# EAGLE design SSROZ (EAGLE 5.07)
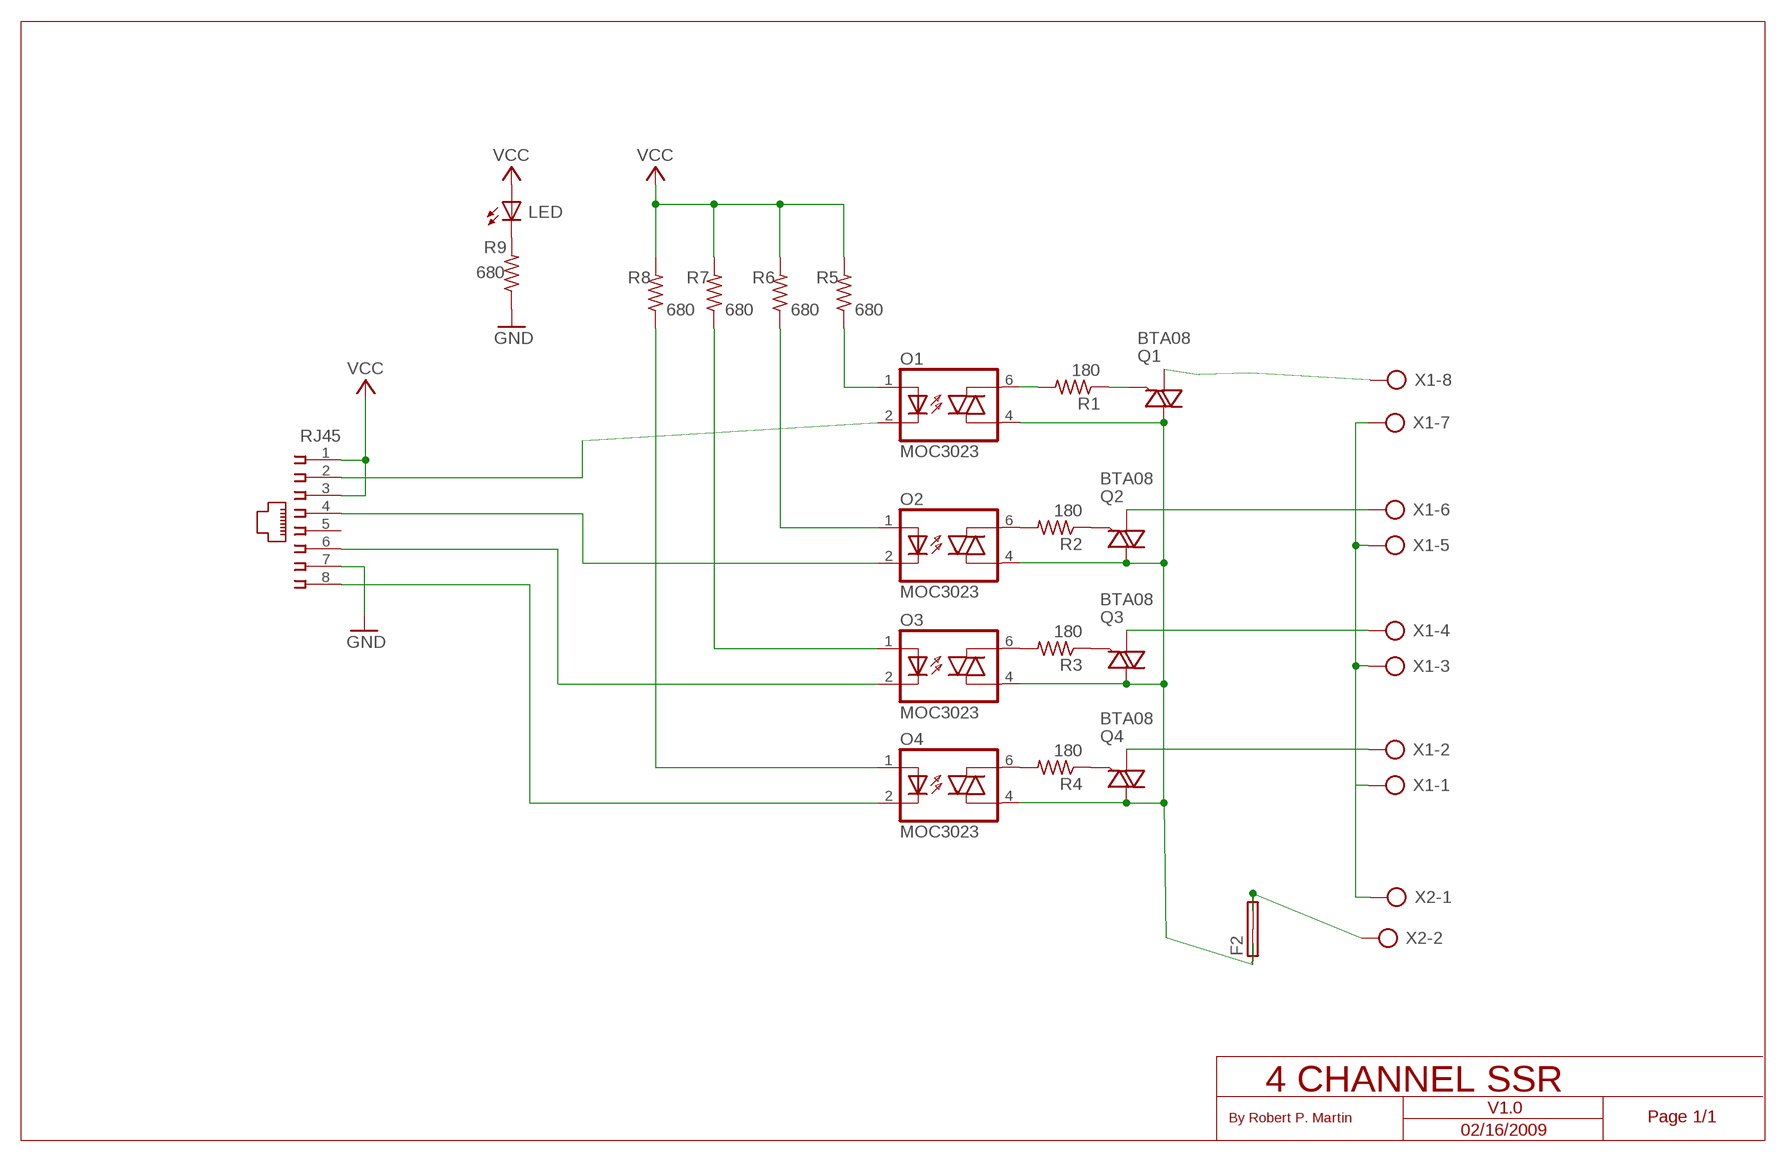
[diagram p0: schematic, sheet 1]

## Parts
F2  SHK20L  [SHK20L]
LED  LED5MM  [LED5MM]
O1  MOC3023  MOC3010M  [DIL06]
O2  MOC3023  MOC3010M  [DIL06]
O3  MOC3023  MOC3010M  [DIL06]
O4  MOC3023  MOC3010M  [DIL06]
Q1  BTA08  TIC225S  [TO220DS]
Q2  BTA08  TIC225S  [TO220DS]
Q3  BTA08  TIC225S  [TO220DS]
Q4  BTA08  TIC225S  [TO220DS]
R1  180  R-US_0207/10  [0207/10]
R2  180  R-US_0207/10  [0207/10]
R3  180  R-US_0207/10  [0207/10]
R4  180  R-US_0207/10  [0207/10]
R5  680  R-US_0204/7  [0204/7]
R6  680  R-US_0204/7  [0204/7]
R7  680  R-US_0204/7  [0204/7]
R8  680  R-US_0204/7  [0204/7]
R9  680  R-US_0204/7  [0204/7]
RJ45  520251-4  [520251-4]
X1  AK500/8  [AK500/8]
X2  AK500/2  [AK500/2]

## Nets
GND: R9.1 RJ45.7
HOT: F2.1A O1.4(A1) O2.4(A1) O3.4(A1) O4.4(A1) Q1.A2 Q2.A2 Q3.A2 Q4.A2
N$1: O1.1(A) R5.1
N$2: O2.1(A) R6.1
N$3: O3.1(A) R7.1
N$4: O4.1(A) R8.1
N$5: O1.2(C) RJ45.2
N$6: O2.2(C) RJ45.4
N$7: O3.2(C) RJ45.6
N$8: O4.2(C) RJ45.8
N$9: F2.2A F2.2B X2.2
N$10: LED.K(C) R9.2
N$12: Q1.A1 X1.8
N$13: Q1.G R1.1
N$27: Q2.G R2.1
N$28: Q3.G R3.1
N$29: Q4.G R4.1
N$30: O4.6(A2) R4.2
N$31: O3.6(A2) R3.2
N$33: O2.6(A2) R2.2
N$35: O1.6(A2) R1.2
N$43: Q2.A1 X1.6
N$48: Q3.A1 X1.4
N$49: Q4.A1 X1.2
NEUTRAL: X1.1 X1.3 X1.5 X1.7 X2.1
VCC: LED.A R5.2 R6.2 R7.2 R8.2 RJ45.1 RJ45.3
Unconnected: F2.1B RJ45.5

## Notes on the sheet
- 4 CHANNEL SSR
- V1.0
- By Robert P. Martin | Page 1/1
- 02/16/2009

## Library data of the parts
F2 = fuse:SHK20L: FUSE HOLDER 5 x 20 mm, SH contact, SHH1 Schukat, E1073 Buerklin
LED = led:LED: LED OSRAM: - CHIPLED LG R971, LG N971, LY N971, LG Q971, LY Q971, LO R971, LY R971 LH N974, LH R974 LS Q976, LO Q976, LY Q976 LO Q996 - Hyper CHIPLED LW Q18S LB Q993, LB Q99A, LB R99A - SideLED LS A670, LO A670, LY A670, LG A670, LP A670 LB A673, LV A673, LT A673, LW A673 LH A674 LY A675 LS A676, LA A676, LO A676, LY A676, LW A676 LS A679, LY A679, LG A679 - Hyper Micro SIDELED® LS Y876, LA Y876, LO Y876, LY Y876 LT Y87S - SmartLED LW L88C, LW L88S LB L89C, LB L89S, LG L890 LS L89K, LO L89K, LY L89K LS L896, LA L896, LO L896, LY L896 - TOPLED LS T670, LO T670, LY T670, LG T670, LP T670 LSG T670, LSP T670, LSY T670, LOP T670, LYG T670 LG T671, LOG T671, LSG T671 LB T673, LV T673, LT T673, LW T673 LH T674 LS T676, LA T676, LO T676, LY T676, LB T676, LH T676, LSB T676, LW T676 LB T67C, LV T67C, LT T67C, LS T67K, LO T67K, LY T67K, LW E67C LS E67B, LA E67B, LO E67B, LY E67B, LB E67C, LV E67C, LT E67C LW T67C LS T679, LY T679, LG T679 LS T770, LO T770, LY T770, LG T770, LP T770 LB T773, LV T773, LT T773, LW T773 LH T774 LS E675, LA E675, LY E675, LS T675 LS T776, LA T776, LO T776, LY T776, LB T776 LHGB T686 LT T68C, LB T68C - Hyper Mini TOPLED® LB M676 - Mini TOPLED Santana® LG M470 LS M47K, LO M47K, LY M47K Source: http://www.osram.convergy.de - LUMILED® LXK2-PW12-R00, LXK2-PW12-S00, LXK2-PW14-U00, LXK2-PW14-V00 LXK2-PM12-R00, LXK2-PM12-S00, LXK2-PM14-U00 LXK2-PE12-Q00, LXK2-PE12-R00, LXK2-PE12-S00, LXK2-PE14-T00, LXK2-PE14-U00 LXK2-PB12-K00, LXK2-PB12-L00, LXK2-PB12-M00, LXK2-PB14-N00, LXK2-PB14-P00, LXK2-PB14-Q00 LXK2-PR12-L00, LXK2-PR12-M00, LXK2-PR14-Q00, LXK2-PR14-R00 LXK2-PD12-Q00, LXK2-PD12-R00, LXK2-PD12-S00 LXK2-PH12-R00, LXK2-PH12-S00 LXK2-PL12-P00, LXK2-PL12-Q00, LXK2-PL12-R00 Source: www.luxeon.com
O1-O4 = optocoupler:MOC30*M: RANDOM-PHASE OPTOISOLATORS TRIAC DRIVER OUTPUT Source: http://www.fairchildsemi.com MOC3020-M.pdf
Q1-Q4 = triac:TIC225S: TRIAC
R1-R9 = rcl:R-US_: RESISTOR, American symbol
RJ45 = con-amp:520251-4: AMP connector
X1 = con-ptr500:AK500/8: CONNECTOR
X2 = con-ptr500:AK500/2: CONNECTOR

## Board
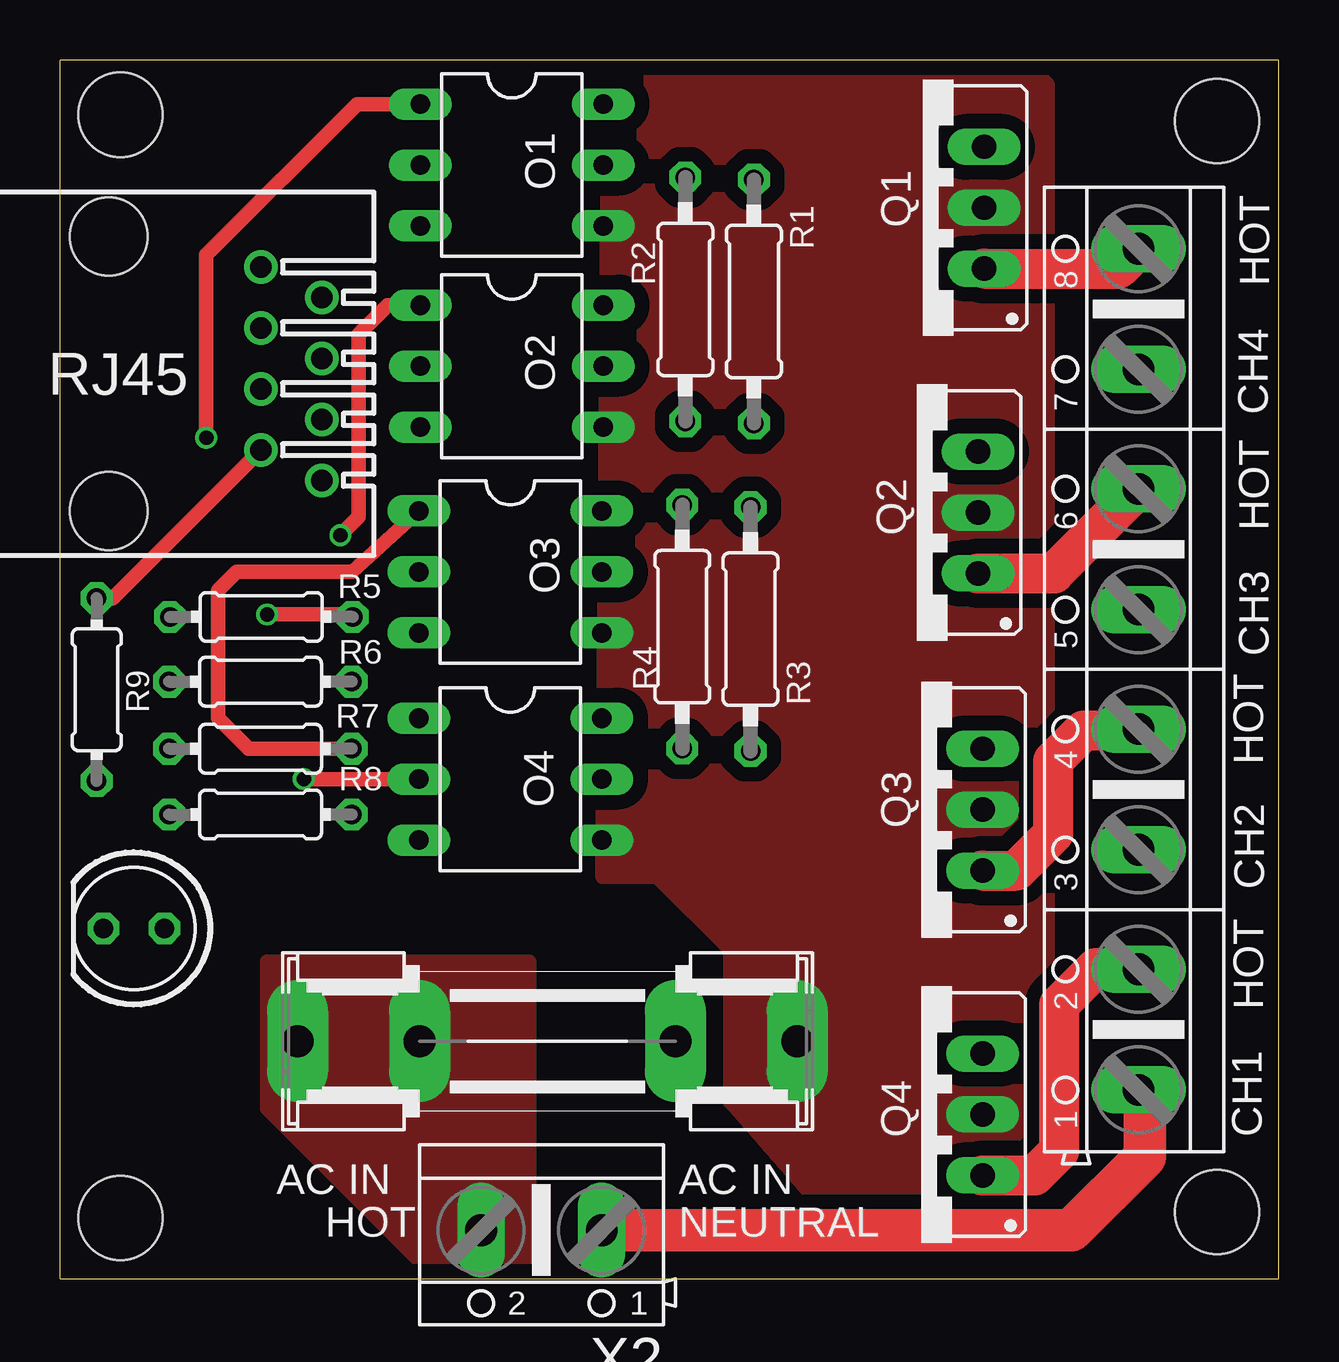
[diagram p1: board, top side]
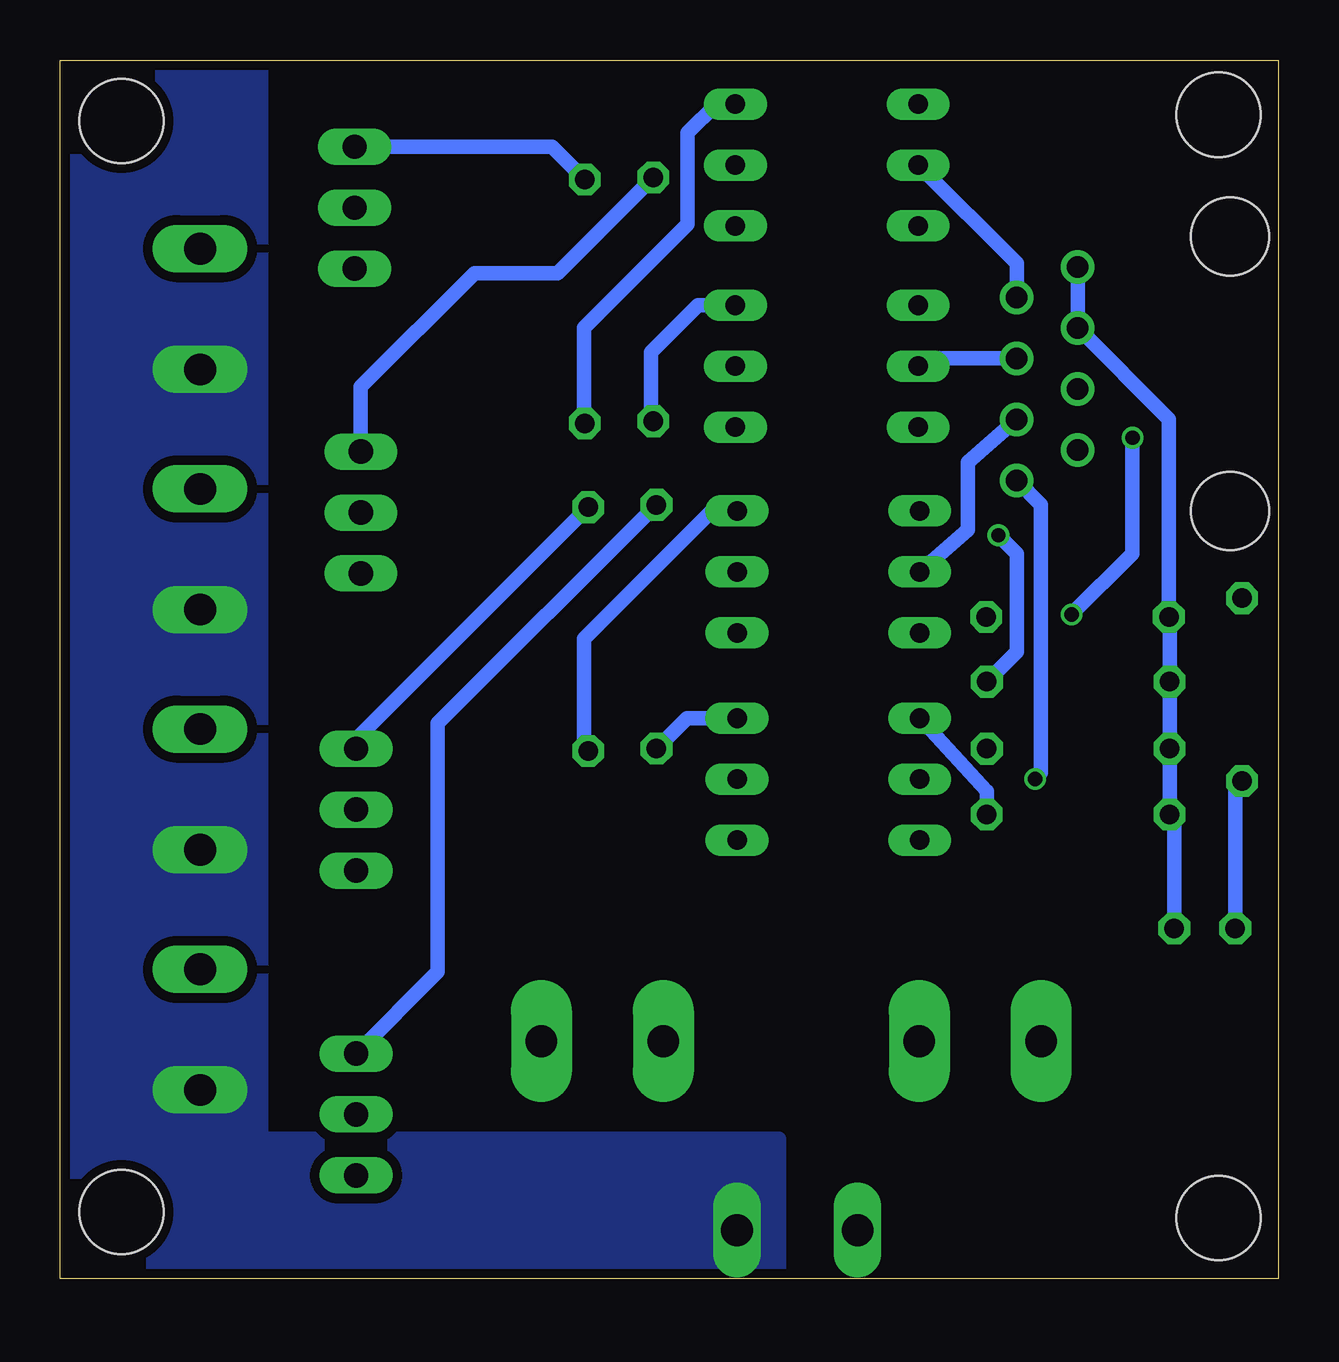
[diagram p2: board, bottom side, seen from below]

Size 50.8 x 50.79 mm. Coordinates in mm from the lower left corner, seen from the top.
Outline: 0,0 50.8,0 50.8,50.79 0,50.79 0,0
Copper layers (1*16): Top 0.035mm / dielectric 1.5mm / Bottom 0.035mm
Design rules "ITEADstudio_DRC": minimum track width 6mil, minimum drill 12mil, track to track 6mil, track to pad 6mil, pad to pad 6mil, via to via 6mil, smd to smd 0mil, copper to edge 10mil, drill to drill 10mil, minimum pad ring 10mil, minimum via ring 6mil, stop-mask expansion 2mil, vias tented up to drill 100mil, thermal gap 10mil
Holes 3.51 mm at 48.23,48.26 48.23,2.79 2.51,48.51 2.51,2.54

### Footprints (pad centres in the part's own frame; a part is rotated, then mirrored left to right if it is on the bottom)
SHK20L = drill 1.321 pad 2.54 long: 1A -10.414,0; 1B -5.334,0; 2A 10.414,0; 2B 5.334,0
LED5MM = drill 0.813 octagon: A -1.27,0; K 1.27,0
DIL06 = drill 0.813 long: 1 -2.54,-3.81; 2 0,-3.81; 3 2.54,-3.81; 4 2.54,3.81; 5 0,3.81; 6 -2.54,3.81
TO220DS = drill 1.016 long: A1 -2.54,-2.54; A2 0,-2.54; G 2.54,-2.54
0207/10 = drill 0.813 octagon: 1 -5.08,0; 2 5.08,0
0204/7 = drill 0.813 octagon: 1 -3.81,0; 2 3.81,0
520251-4 = drill 0.889 round: 1 -4.445,6.35; 2 -3.175,8.89; 3 -1.905,6.35; 4 -0.635,8.89; 5 0.635,6.35; 6 1.905,8.89; 7 3.175,6.35; 8 4.445,8.89 | hole 3.251: -5.715,0; 5.715,0
AK500/8 = drill 1.321 long: 1 -17.526,0; 2 -12.497,0; 3 -7.518,0; 4 -2.489,0; 5 2.489,0; 6 7.518,0; 7 12.497,0; 8 17.526,0
AK500/2 = drill 1.321 long: 1 -2.515,0; 2 2.515,0

### Placement (x,y rotation side)
F2  20.32,9.91 180 top
LED  3.08,14.61 180 top
O1  18.83,46.41 270 top
O2  18.83,38.03 270 top
O3  18.77,29.46 270 top
O4  18.77,20.82 270 top
Q1  35.98,44.64 90 top
Q2  35.72,31.94 90 top
Q3  35.92,19.55 90 top
Q4  35.92,6.85 90 top
R1  28.92,40.73 270 top
R2  26.07,40.82 270 top
R3  28.78,27.08 270 top
R4  25.94,27.18 270 top
R5  8.39,27.59 180 top
R6  8.36,24.89 180 top
R7  8.36,22.09 180 top
R8  8.36,19.35 180 top
R9  1.53,24.55 270 top
RJ45  2.03,37.72 270 top
X1  44.96,25.4 90 top
X2  20.07,2.03 180 top

### Tracks (layer width: path | path; a pad name or v marks a point on that pad's centre or on a via)
GND
  Top 0.61: R9.1 2.2,28.36 RJ45.7
HOT
  pour Top (isolate 0.61, no thermals): 22.86,50.8 22.61,16.76 24.89,16.76 27.94,13.72 27.94,7.37 28.19,7.11 33.27,1.27 40.89,1.27 41.15,1.52 41.15,49.78 39.88,51.05
N$1  (via drill 0.6)
  Top 0.61: O1.1 12.38,48.95 6.1,42.67 v6.1,35.05 | v8.64,27.69 12.1,27.69 R5.1
  Bottom 0.61: v6.1,35.05 6.1,30.23 v8.64,27.69
N$2  (via drill 0.6)
  Top 0.61: O2.1 13.65,40.57 12.45,39.37 12.45,31.75 v11.68,30.99
  Bottom 0.61: v11.68,30.99 10.92,30.23 10.92,26.13 R6.1
N$3
  Top 0.61: O3.1 12.19,29.46 9.4,29.46 7.37,29.46 6.6,28.7 6.6,23.37 7.87,22.1 R7.1
N$4
  Bottom 0.61: R8.1 12.17,20.32 O4.1
N$5
  Bottom 0.61: O1.2 10.92,42.31 RJ45.2
N$6
  Bottom 0.61: O2.2 14.7,38.35 RJ45.4
N$7
  Bottom 0.61: O3.2 12.95,31.21 12.95,34.04 RJ45.6
N$8  (via drill 0.6)
  Top 0.61: v10.16,20.83 O4.2
  Bottom 0.61: O4.2 14.96,20.55 14.71,20.55 | RJ45.8 9.91,32.26 9.91,21.08 v10.16,20.83
N$9
  pour Top (isolate 0.61, no thermals): 8.64,13.21 19.56,13.21 19.56,0.51 15.24,0.51 8.64,7.11
N$10
  Bottom 0.61: LED.K 1.81,20.46 R9.2
N$12
  Top 1.676: Q1.A1 44.13,42.1 X1.8
N$13
  Bottom 0.61: Q1.G 30.29,47.18 R1.1
N$14
  Top 1.778: 22.86,2.03 42.16,2.03 45.21,5.08 45.21,7.87
N$27
  Bottom 0.61: Q2.G 38.26,37.17 33.53,41.91 30.05,41.91 R2.1
N$28
  Bottom 0.61: Q3.G 38.46,22.48 R3.1
N$29
  Bottom 0.61: R4.1 35.05,23.15 35.05,12.8 Q4.G
N$30
  Bottom 0.61: O4.6 24.67,23.36 R4.2
N$31
  Bottom 0.61: O3.6 23.63,32 28.96,26.67 28.96,22.17 R3.2
N$33
  Bottom 0.61: O2.6 24.2,40.57 26.16,38.61 26.16,35.83 R2.2
N$35
  Bottom 0.61: O1.6 23.44,48.95 24.64,47.75 24.64,43.94 28.96,39.62 28.96,35.68 R1.2
N$43
  Top 1.676: Q2.A1 41.43,29.4 X1.6
N$48
  Top 1.676: Q3.A1 39.87,17.01 41.4,18.54 41.4,21.59 42.67,22.86 44.91,22.86 X1.4
N$49
  Top 1.676: Q4.A1 40.63,4.31 41.66,5.33 41.66,11.43 43.18,12.95 44.91,12.95 X1.2
NEUTRAL
  pour Bottom (isolate 0.406, no thermals): 50.8,0 50.8,0.76 50.55,51.05 42.42,51.05 42.42,5.84 20.83,5.84 20.83,0
VCC
  Bottom 0.61: LED.A 4.35,19.16 R8.2 R7.2 R6.2 4.55,27.55 R5.2 4.58,35.82 RJ45.3 RJ45.1

### Text on the board
tPlace: HOT | HOT | HOT | HOT
tNames: CH4 | CH3 | CH2 | CH1 | AC IN | AC IN | HOT | NEUTRAL